# EAGLE schematic Schematic (EAGLE 9.3.0)
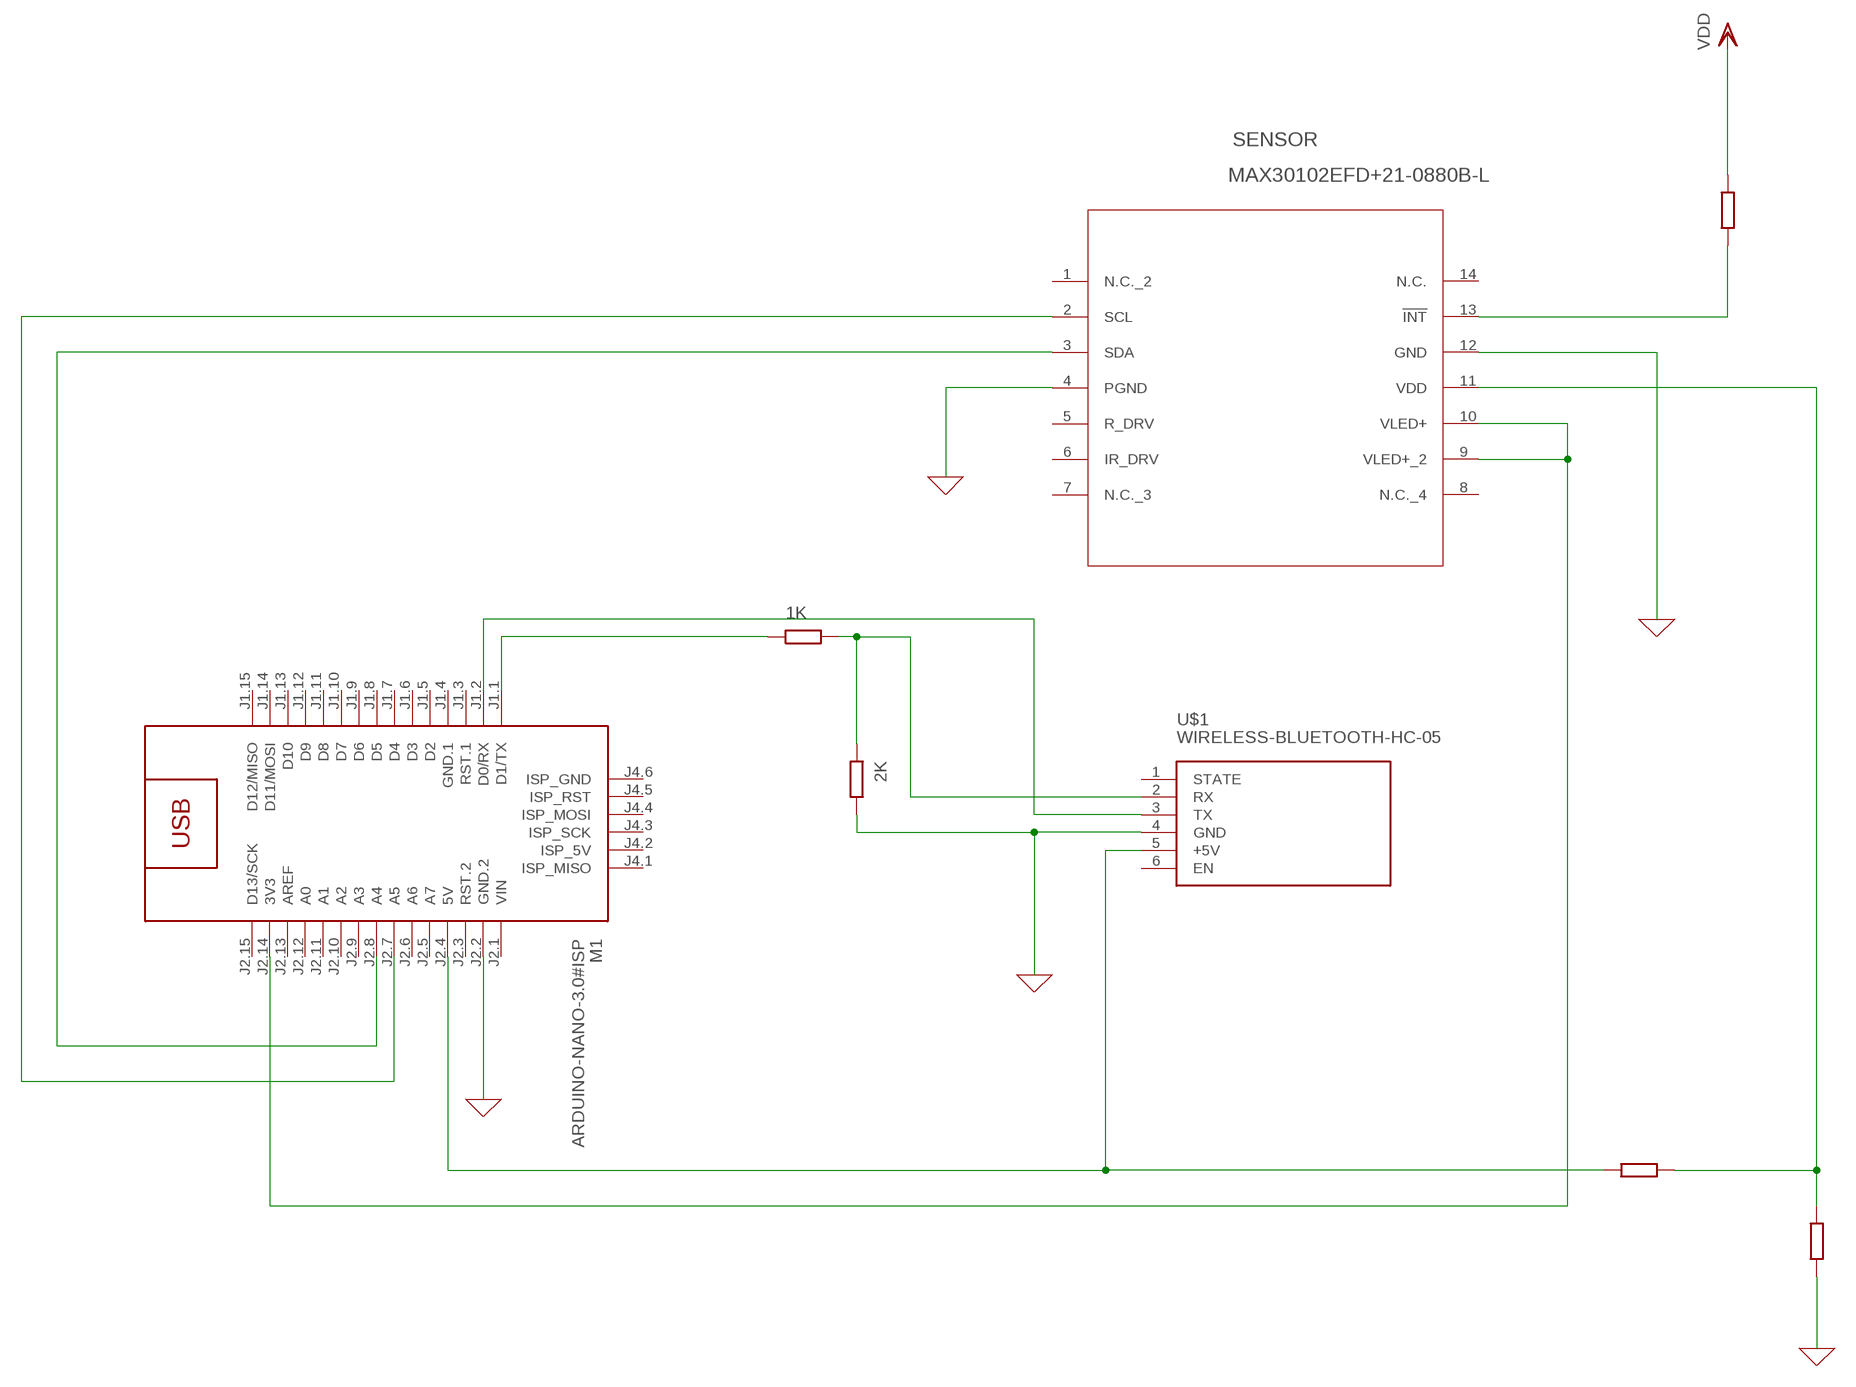
[diagram p0: schematic, sheet 1]

## Parts
1K  R  (no package)
2K  R  (no package)
M1  ARDUINO-NANO-3.0#ISP  [ARDUINO-NANO-3.0#ISP]
SENSOR  MAX30102EFD+21-0880B-L  [21-0880B-L]
U$1  WIRELESS-BLUETOOTH-HC-05  [WIRELESS-BLUETOOTH-HC-05]

## Nets
0: 2K.2 M1.J2.2(GND.2) SENSOR.4(PGND) SENSOR.12(GND) U$1.4(GND) ; supply symbol labelled GND
N$1: M1.J1.2(D0/RX) U$1.3(TX)
N$2: SENSOR.13(!INT)
N$3: 1K.1 M1.J1.1(D1/TX)
N$4: 1K.2 2K.1 U$1.2(RX)
N$5: M1.J2.7(A5) SENSOR.2(SCL)
N$6: M1.J2.8(A4) SENSOR.3(SDA)
N$7: M1.J2.4(5V) U$1.5(+5V)
N$8: M1.J2.14(3V3) SENSOR.9(VLED+_2) SENSOR.10(VLED+)
N$9: SENSOR.11(VDD)
Unconnected: M1.J1.3(RST.1) M1.J1.5(D2) M1.J1.6(D3) M1.J1.7(D4) M1.J1.8(D5) M1.J1.9(D6) M1.J1.10(D7) M1.J1.11(D8) M1.J1.12(D9) M1.J1.13(D10) M1.J1.14(D11/MOSI) M1.J1.15(D12/MISO) M1.J2.3(RST.2) M1.J2.5(A7) M1.J2.6(A6) M1.J2.9(A3) M1.J2.10(A2) M1.J2.11(A1) M1.J2.12(A0) M1.J2.13(AREF) M1.J2.15(D13/SCK) M1.J4.1(ISP_MISO) M1.J4.2(ISP_5V) M1.J4.3(ISP_SCK) M1.J4.4(ISP_MOSI) M1.J4.5(ISP_RST) M1.J4.6(ISP_GND) SENSOR.1(N.C._2) SENSOR.5(R_DRV) SENSOR.6(IR_DRV) SENSOR.7(N.C._3) SENSOR.8(N.C._4) SENSOR.14(N.C.) U$1.1(STATE) U$1.6(EN)

## Power pins joined to a net without a drawn wire
GND.1: M1.J1.4(GND.1)
VIN: M1.J2.1(VIN)

## Library data of the parts
1K 2K = ngspice-simulation:R: RESISTOR
M1 = diy-modules:ARDUINO-NANO-3.0#ISP: Arduino Nano 3.0 (and compatible devices) with ISP pads More details available here: https://www.arduino.cc/en/Main/ArduinoBoardNano Click here to find device on ebay.com <http://www.ebay.com/sch/arduino+nano>
SENSOR = MAXLIB:MAX30102EFD+; MANUFACTURER_PART_NUMBER: MAX30102EFD+; VENDOR: Maxim Integrated Products
U$1 = diy-modules:WIRELESS-BLUETOOTH-HC-05: Bluetooth Transceiver Module based on HC-05 board Tutorial is available here: https://arduino-info.wikispaces.com/BlueTooth-HC05-HC06-Modules-How-To Click here to find device on ebay.com <http://www.ebay.com/sch/hc-05+module+rs232>